# EAGLE design DTB_Brushed_Power_Board 2.0 (EAGLE 9.6.2)
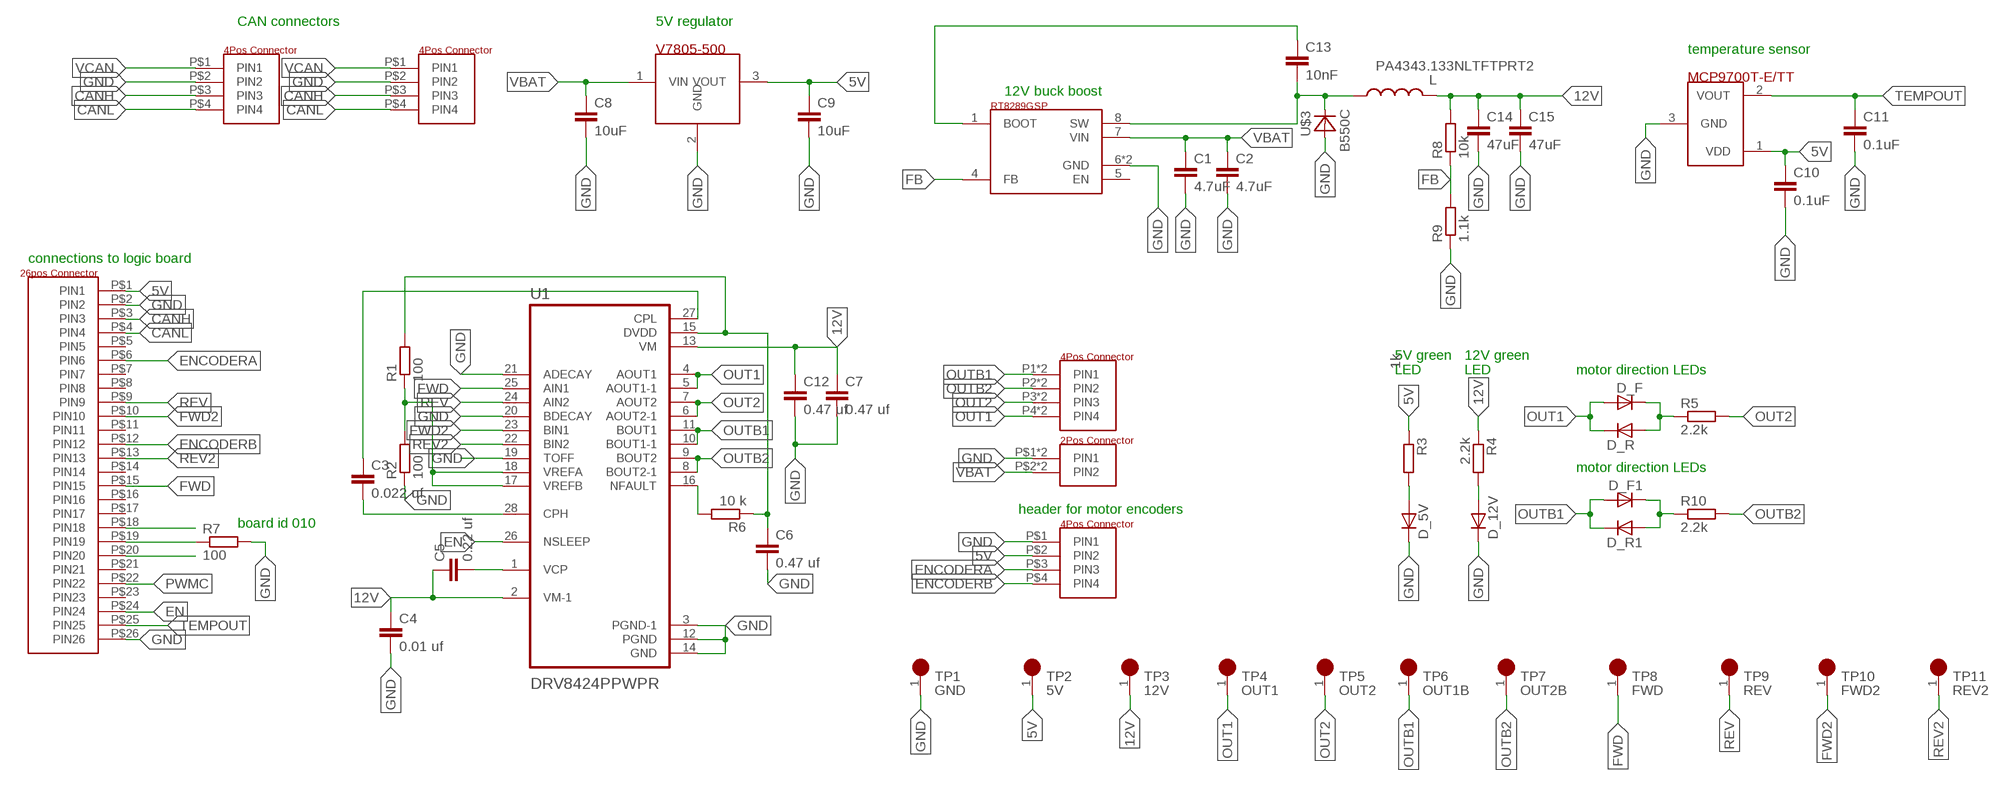
[diagram p0: schematic, sheet 1]

## Parts
C1  4.7uF  C-EUC1206  [C1206]
C2  4.7uF  C-EUC1206  [C1206]
C3  0.022 uf  C-EUC1206  [C1206]
C4  0.01 uf  C-EUC1206  [C1206]
C5  0.22 uf  C-EUC1206  [C1206]
C6  0.47 uf  C-EUC1206  [C1206]
C7  0.47 uf  C-EUC1206  [C1206]
C8  10uF  C-EUC1206  [C1206]
C9  10uF  C-EUC1206  [C1206]
C10  0.1uF  C-EUC0603  [C0603]
C11  0.1uF  C-EUC0603  [C0603]
C12  0.47 uf  C-EUC1206  [C1206]
C13  10nF  C-EUC1206  [C1206]
C14  47uF  C-EUC1206  [C1206]
C15  47uF  C-EUC1206  [C1206]
D_5V  LED0603  [DO0603]
D_12V  LED0603  [DO0603]
D_F  LED0603  [DO0603]
D_F1  LED0603  [DO0603]
D_R  LED0603  [DO0603]
D_R1  LED0603  [DO0603]
L  PA4343.133NLTFTPRT2  [INDM140128X650N]
R1  100  R-EU_R0603  [R0603]
R2  100  R-EU_R0603  [R0603]
R3  1k  R-EU_R0603  [R0603]
R4  2.2k  R-EU_R0603  [R0603]
R5  2.2k  R-EU_R0603  [R0603]
R6  10 k  R-EU_R0603  [R0603]
R7  100  R-EU_R0603  [R0603]
R8  10k  R-EU_R0603  [R0603]
R9  1.1k  R-EU_R0603  [R0603]
R10  2.2k  R-EU_R0603  [R0603]
TP1  GND  S2751-46R  [HARWIN_S2751-46R]
TP2  5V  S2751-46R  [HARWIN_S2751-46R]
TP3  12V  S2751-46R  [HARWIN_S2751-46R]
TP4  OUT1  S2751-46R  [HARWIN_S2751-46R]
TP5  OUT2  S2751-46R  [HARWIN_S2751-46R]
TP6  OUT1B  S2751-46R  [HARWIN_S2751-46R]
TP7  OUT2B  S2751-46R  [HARWIN_S2751-46R]
TP8  FWD  S2751-46R  [HARWIN_S2751-46R]
TP9  REV  S2751-46R  [HARWIN_S2751-46R]
TP10  FWD2  S2751-46R  [HARWIN_S2751-46R]
TP11  REV2  S2751-46R  [HARWIN_S2751-46R]
U1  DRV8424PPWPR  [IC_TPS61196PWPRQ1]
U$2  RT8289GSP  [SO8]
U$3  B550C  [SMC]
U$4  2POS_CONNECTOR,1X2_45A_POWERPOLE  [POWERPOLE_45A_1X2]
U$6  4POS_CONNECTORPOWERPOLE_1X4  [POWERPOLE_45A_1X4]
U$7  4POS_CONNECTORMOLEX_MICROFIT3.0_RA_4PIN_2ROW  [MOLEX_MICROFIT3.0_0430450400]
U$8  4POS_CONNECTORMOLEX_MICROFIT3.0_RA_4PIN_2ROW  [MOLEX_MICROFIT3.0_0430450400]
U$9  V7805-500  [SIP3]
U$10  26POS_CONNECTORN2526-6002-RB  [N2526-6002-RB]
U$11  MCP9700T-E/TT  [SOT23]
U$12  4POS_CONNECTOR.1"HEADER  [4POS_HEADER_.1"]

## Nets
5V: C9.1 C10.1 R3.1 TP2.1(TP) U$9.3(VOUT) U$10.P$1(PIN1) U$11.1(VDD) U$12.P$2(PIN2)
12V: C4.1 C5.1 C7.1 C12.1 C14.1 C15.1 L.2 R4.1 R8.2 TP3.1(TP) U1.2(VM-1) U1.13(VM)
BOOT: C13.1 U$2.1(BOOT)
CANH: U$7.P$3(PIN3) U$8.P$3(PIN3) U$10.P$3(PIN3)
CANL: U$7.P$4(PIN4) U$8.P$4(PIN4) U$10.P$4(PIN4)
EN: U1.26(NSLEEP) U$10.P$24(PIN24)
ENCODERA: U$10.P$6(PIN6) U$12.P$3(PIN3)
ENCODERB: U$10.P$12(PIN12) U$12.P$4(PIN4)
FB: R8.1 R9.2 U$2.4(FB)
FWD: TP8.1(TP) U1.25(AIN1) U$10.P$15(PIN15)
FWD2: TP10.1(TP) U1.23(BIN1) U$10.P$10(PIN10)
GND: C1.2 C2.2 C4.2 C6.2 C7.2 C8.2 C9.2 C10.2 C11.2 C12.2 C14.2 C15.2 D_5V.2(C) D_12V.2(C) R2.1 R7.2 R9.1 TP1.1(TP) U1.3(PGND-1) U1.12(PGND) U1.14(GND) U1.19(TOFF) U1.20(BDECAY) U1.21(ADECAY) U$2.6(GND) U$2.GND,EXPOSEDPAD(GND) U$3.A U$4.P$1(PIN1) U$4.P$5(PIN1) U$7.P$2(PIN2) U$8.P$2(PIN2) U$9.2(GND) U$10.P$2(PIN2) U$10.P$26(PIN26) U$11.3(GND) U$12.P$1(PIN1)
N$1: U$10.P$18(PIN18)
N$2: R6.2 U1.16(NFAULT)
N$3: D_F.2(C) D_R.1(A) R5.1
N$4: R7.1 U$10.P$19(PIN19)
N$5: U$10.P$20(PIN20)
N$6: C6.1 R1.2 R6.1 U1.15(DVDD)
N$7: D_5V.1(A) R3.2
N$8: D_12V.1(A) R4.2
N$9: C5.2 U1.1(VCP)
N$10: C13.2 L.1 U$2.8(SW) U$3.C
N$11: D_F1.2(C) D_R1.1(A) R10.1
N$14: R1.1 R2.2 U1.17(VREFB) U1.18(VREFA)
N$16: C3.2 U1.28(CPH)
OUT1: D_F.1(A) D_R.2(C) TP4.1(TP) U1.4(AOUT1) U1.5(AOUT1-1) U$6.P4(PIN4) U$6.P4B(PIN4)
OUT2: R5.2 TP5.1(TP) U1.6(AOUT2-1) U1.7(AOUT2) U$6.P3(PIN3) U$6.P3B(PIN3)
OUTB1: D_F1.1(A) D_R1.2(C) TP6.1(TP) U1.10(BOUT1-1) U1.11(BOUT1) U$6.P1(PIN1) U$6.P1B(PIN1)
OUTB2: R10.2 TP7.1(TP) U1.8(BOUT2-1) U1.9(BOUT2) U$6.P2(PIN2) U$6.P2B(PIN2)
PWMC: U$10.P$22(PIN22)
REV: TP9.1(TP) U1.24(AIN2) U$10.P$9(PIN9)
REV2: TP11.1(TP) U1.22(BIN2) U$10.P$13(PIN13)
TEMPOUT: C11.1 U$10.P$25(PIN25) U$11.2(VOUT)
VBAT: C1.1 C2.1 C8.1 U$2.7(VIN) U$4.P$2(PIN2) U$4.P$6(PIN2) U$9.1(VIN)
VBAT1: C3.1 U1.27(CPL)
VCAN: U$7.P$1(PIN1) U$8.P$1(PIN1)
Unconnected: U$2.5(EN) U$10.P$5(PIN5) U$10.P$7(PIN7) U$10.P$8(PIN8) U$10.P$11(PIN11) U$10.P$14(PIN14) U$10.P$16(PIN16) U$10.P$17(PIN17) U$10.P$21(PIN21) U$10.P$23(PIN23)

## Notes on the sheet
- CAN connectors | 5V regulator
- temperature sensor
- 12V buck boost
- connections to logic board
- 5V green
  LED
- 12V green
  LED
- motor direction LEDs
- motor direction LEDs
- header for motor encoders
- board id 010

## Library data of the parts
C1-C15 = rcl:C-EU: CAPACITOR, European symbol; SPICEPREFIX: C
D_5V D_12V D_F D_F1 D_R D_R1 = CMR:LED0603: LED size 0603 for debugging pic
L = CMR:PA4343.133NLT
R1-R10 = rcl:R-EU_: RESISTOR, European symbol; SPICEPREFIX: R
TP1-TP11 = CMR:S2751-46R: EZ-Test Point, SMT, tin, Tape and Reeled Check prices <https://pricing.snapeda.com/parts/S2751-46R/Harwin%20Inc./view-part?ref=eda>; AVAILABILITY: In Stock; DESCRIPTION: Natural PC Test Point Brass, Tin Plating Surface Mount Mounting Type; MF: Harwin Inc.; MP: S2751-46R; PACKAGE: None; PRICE: None; PURCHASE-URL: https://pricing.snapeda.com/search/part/S2751-46R/?ref=eda
U1 = DRV8424PPWPR:DRV8424PPWPR: None Check prices <https://pricing.snapeda.com/parts/DRV8424PPWPR/Texas%20Instruments/view-part?ref=eda>; AVAILABILITY: In Stock; DESCRIPTION: 35V, 2.5A bipolar stepper or dual brushed motor driver with integrated current sensing 28-HTSSOP -40 to 125; MF: Texas Instruments; MP: DRV8424PPWPR; PACKAGE: HTSSOP-28 Texas Instruments; PRICE: None; PURCHASE-URL: https://pricing.snapeda.com/search/part/DRV8424PPWPR/?ref=eda
U$2 = CMR:RT8289GSP: Voltage Regulator 24V sweep to 5V
U$3 = CMR:B550C: smc diode for voltage regulator 24 >> 5
U$4 = CMR:2POS_CONNECTOR: Harwin 2mm 2 POS Connector Male - https://www.digikey.com/product-detail/en/harwin-inc/M80-8520242/952-1769-ND/3727738 Female - https://www.digikey.com/product-detail/en/harwin-inc/M80-8980205/952-1182-ND/2264171
U$6-U$8 U$12 = CMR:4POS_CONNECTOR: 4 position connector could be header or connector
U$9 = CMR:V7805-500: Switching regulator (24V to 5V); max output current: 500mA
U$10 = CMR:26POS_CONNECTOR
U$11 = CMR:MCP9700T-E/TT: Analog Local Temperature Sensor

## Board
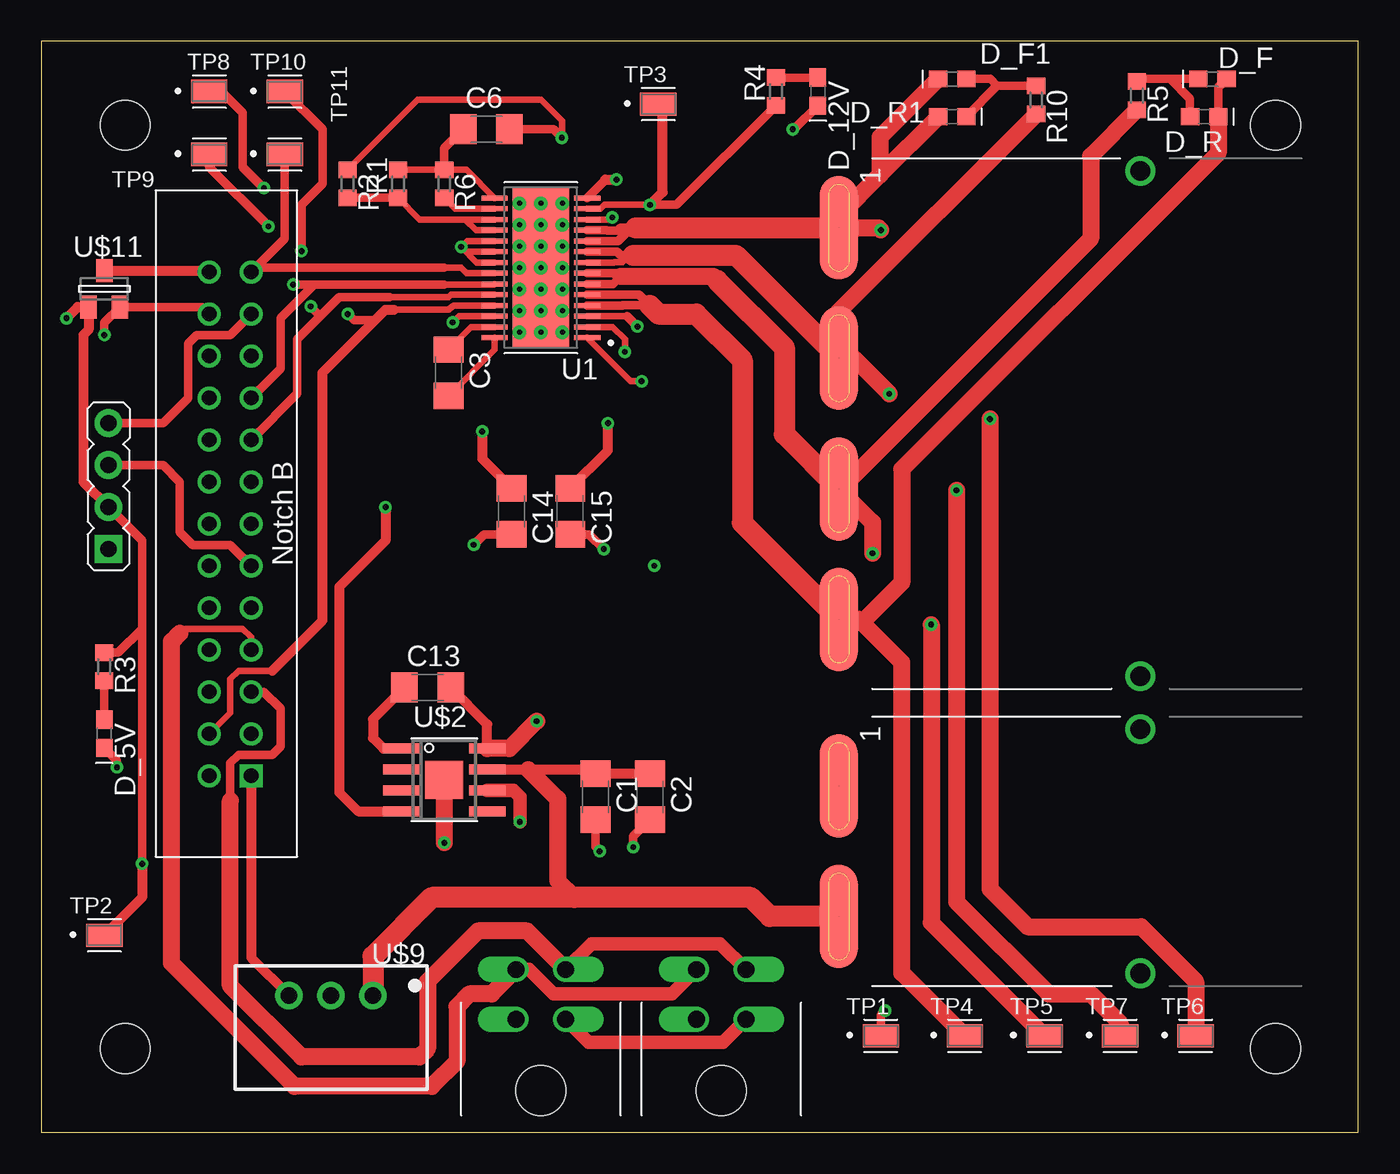
[diagram p1: board, top side]
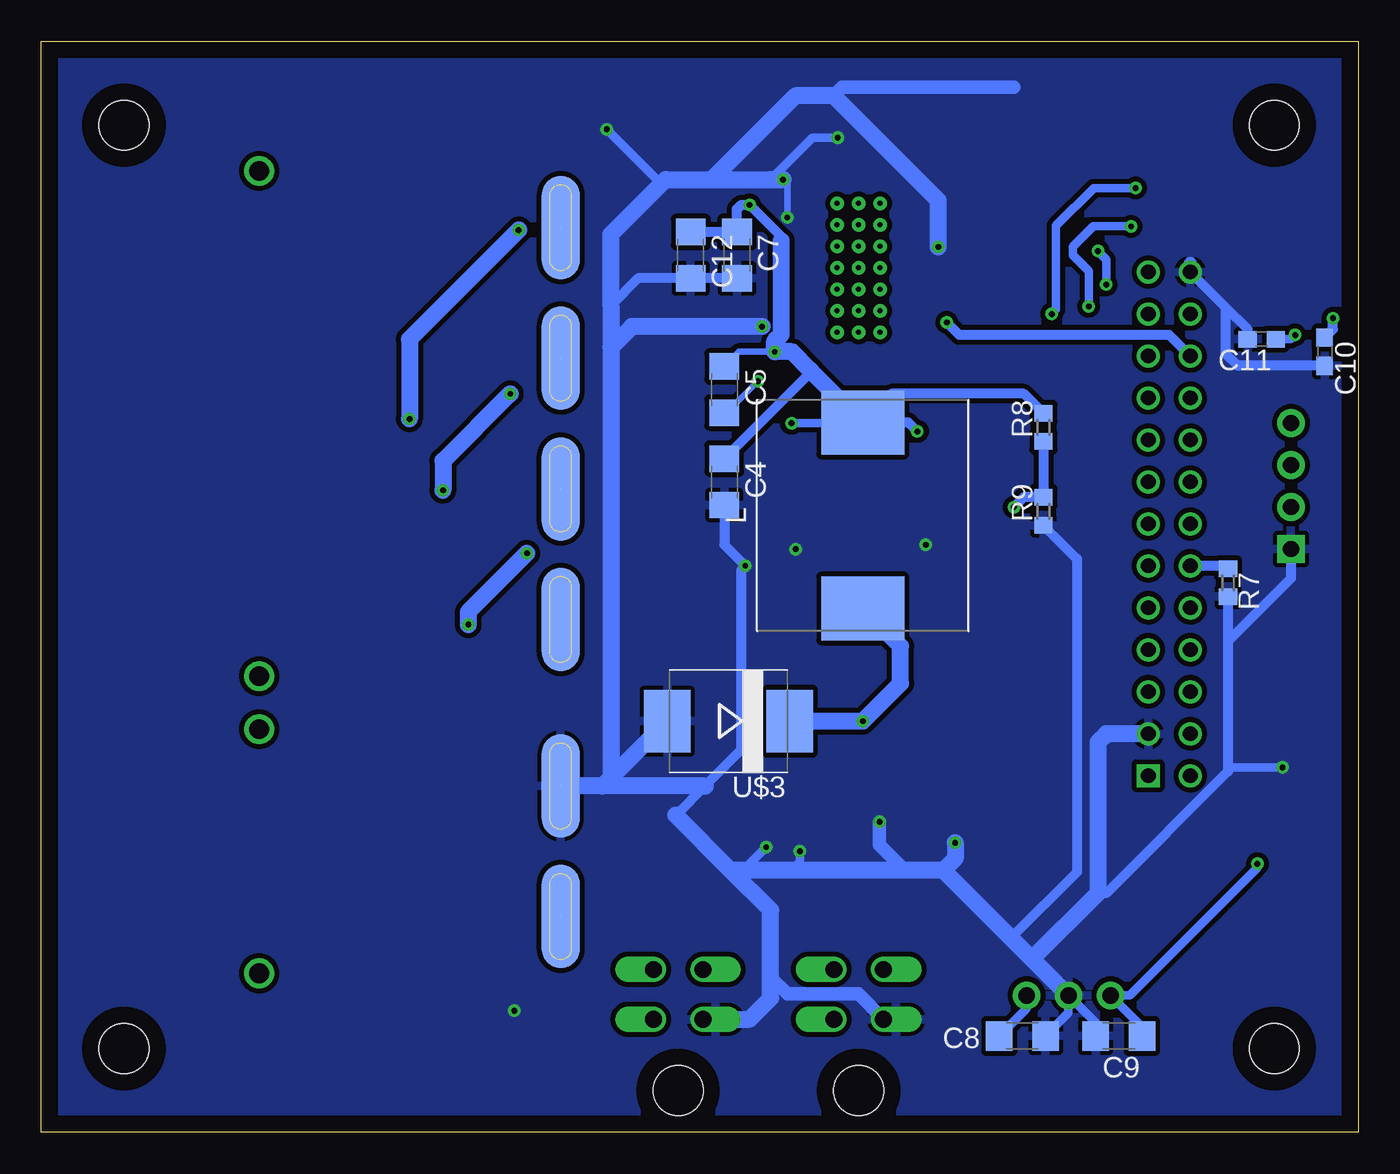
[diagram p2: board, bottom side, seen from below]

Size 79.68 x 66.03 mm. Coordinates in mm from the lower left corner, seen from the top.
Outline: 0,0 79.68,0 79.68,66.03 0,66.03 0,0
Copper layers (1*16): Top 0.035mm / dielectric 1.5mm / Bottom 0.035mm
Design rules "default *": minimum track width 6mil, minimum drill 0.35mm, track to track 6mil, track to pad 6mil, pad to pad 6mil, via to via 6mil, smd to smd 6mil, copper to edge 40mil, drill to drill 6mil, minimum pad ring 10mil, minimum via ring 8mil, stop-mask expansion 4mil, vias tented up to drill 0mil, thermal gap 10mil
Holes 3 mm at 5.08,60.96 74.68,60.96 74.68,5.08 5.08,5.08

### Footprints (pad centres in the part's own frame; a part is rotated, then mirrored left to right if it is on the bottom)
C1206 = smd 1.6 x 1.8: 1 -1.4,0; 2 1.4,0
C0603 = smd 1.1 x 1: 1 -0.85,0; 2 0.85,0
DO0603 = smd 1.1 x 1: 1 -0.85,0; 2 0.85,0
INDM140128X650N = smd 3.862 x 5.012: 1 -5.625,0; 2 5.625,0
R0603 = smd 1 x 1.1: 1 -0.85,0; 2 0.85,0
HARWIN_S2751-46R = smd 2.2 x 1.4: 1 0,0
IC_TPS61196PWPRQ1 = smd 1.6 x 0.3: 1 -2.8,4.225; 2 -2.8,3.575; 3 -2.8,2.925; 4 -2.8,2.275; 5 -2.8,1.625; 6 -2.8,0.975; 7 -2.8,0.325; 8 -2.8,-0.325; 9 -2.8,-0.975; 10 -2.8,-1.625; 11 -2.8,-2.275; 12 -2.8,-2.925; 13 -2.8,-3.575; 14 -2.8,-4.225; 15 2.8,-4.225; 16 2.8,-3.575; 17 2.8,-2.925; 18 2.8,-2.275; 19 2.8,-1.625; 20 2.8,-0.975; 21 2.8,-0.325; 22 2.8,0.325; 23 2.8,0.975; 24 2.8,1.625; 25 2.8,2.275; 26 2.8,2.925; 27 2.8,3.575; 28 2.8,4.225 | smd 3.4 x 9.7: 29 0,0 | drill 0.3 pad 0.5: 30 0,0; 31 0,1.3; 32 0,2.6; 33 0,3.9; 34 0,-1.3; 35 0,-2.6; 36 0,-3.9; 37 -1.3,3.9; 38 1.3,3.9; 39 -1.3,2.6; 40 1.3,2.6; 41 1.3,1.3; 42 -1.3,1.3; 43 -1.3,0; 44 1.3,0; 45 -1.3,-1.3; 46 1.3,-1.3; 47 -1.3,-2.6; 48 1.3,-2.6; 49 -1.3,-3.9; 50 1.3,-3.9
SO8 = smd 0.6 x 2.2: 1 -1.905,-2.6; 2 -0.635,-2.6; 3 0.635,-2.6; 4 1.905,-2.6; 5 1.905,2.6; 6 0.635,2.6; 7 -0.635,2.6; 8 -1.905,2.6 | smd 2.3 x 2.3: GND,EXPOSEDPAD 0,0
SMC = smd 2.8 x 3.8: A 3.7,0; C -3.7,0
POWERPOLE_45A_1X2 = smd 6.246 x 2.286: P$1 -3.95,0; P$2 3.95,0 | drill 1.2: P$3 -7.39,18.24; P$4 7.39,18.24 | smd 6.246 x 2.286 bottom: P$5 -3.95,0; P$6 3.95,0
POWERPOLE_45A_1X4 = smd 6.246 x 2.286: P1 -3.95,0; P2 3.95,0; P3 11.85,0; P4 19.75,0 | smd 6.246 x 2.286 bottom: P1B -3.95,0; P2B 3.95,0; P3B 11.85,0; P4B 19.75,0 | drill 1.2: P$3 -7.39,18.24; P$4 23.19,18.24
MOLEX_MICROFIT3.0_0430450400 = drill 1.02 offset: P$1 1.5,4.32; P$2 -1.5,4.32; P$3 1.5,7.32; P$4 -1.5,7.32 | hole 3: 0,0
SIP3 = drill 1 pad 1.676: 1 -2.54,-1.943; 2 0,-1.943; 3 2.54,-1.943
N2526-6002-RB = drill 0.889 square: P$1 0,0 | drill 0.889: P$2 2.54,0; P$3 5.08,0; P$4 7.62,0; P$5 10.16,0; P$6 12.7,0; P$7 15.24,0; P$8 17.78,0; P$9 20.32,0; P$10 22.86,0; P$11 25.4,0; P$12 27.94,0; P$13 30.48,0; P$14 0,2.54; P$15 2.54,2.54; P$16 5.08,2.54; P$17 7.62,2.54; P$18 10.16,2.54; P$19 12.7,2.54; P$20 15.24,2.54; P$21 17.78,2.54; P$22 20.32,2.54; P$23 22.86,2.54; P$24 25.4,2.54; P$25 27.94,2.54; P$26 30.48,2.54
SOT23 = smd 1 x 1.4: 1 -0.95,-1.1; 2 0.95,-1.1; 3 0,1.1
4POS_HEADER_.1" = drill 0.991 pad 1.676 square: P$1 0,0 | drill 0.991 pad 1.676: P$2 2.54,0; P$3 5.08,0; P$4 7.62,0

### Placement (x,y rotation side)
C1  33.53,20.32 270 top
C2  36.83,20.32 270 top
C3  24.64,45.97 270 top
C4  38.35,39.37 270 bottom
C5  38.35,44.96 270 bottom
C6  26.92,60.71 0 top
C7  37.59,53.09 270 bottom
C8  20.32,5.84 0 bottom
C9  14.48,5.84 180 bottom
C10  2.03,47.24 270 bottom
C11  5.84,48.01 180 bottom
C12  40.39,53.09 270 bottom
C13  23.37,26.92 0 top
C14  28.45,37.59 270 top
C15  32,37.59 270 top
D_5V  3.81,24.13 270 top
D_12V  46.99,62.99 270 top
D_F  70.87,63.75 180 top
D_F1  55.12,61.47 0 top
D_R  70.36,61.47 0 top
D_R1  55.12,63.75 180 top
L  29.97,37.34 90 bottom
R1  21.59,57.4 90 top
R2  18.54,57.4 270 top
R3  3.81,28.19 270 top
R4  44.45,62.99 90 top
R5  66.29,62.74 270 top
R6  24.38,57.4 270 top
R7  7.87,33.27 270 bottom
R8  19.05,42.67 90 bottom
R9  19.05,37.59 90 bottom
R10  60.2,62.48 270 top
TP1  50.8,5.84 0 top
TP2  3.81,11.94 0 top
TP3  37.34,62.23 0 top
TP4  55.88,5.84 0 top
TP5  60.71,5.84 0 top
TP6  69.85,5.84 0 top
TP7  65.28,5.84 0 top
TP8  10.16,62.99 0 top
TP9  10.16,59.18 0 top
TP10  14.73,62.99 0 top
TP11  14.73,59.18 0 top
U1  30.23,52.32 180 top
U$2  24.38,21.34 270 top
U$3  38.1,24.89 180 bottom
U$4  48.26,17.02 270 top
U$6  48.26,50.8 270 top
U$7  41.15,2.54 0 top
U$8  30.23,2.54 0 top
U$9  17.53,6.35 180 top
U$10  12.7,21.59 90 top
U$11  3.81,51.05 0 top
U$12  4.06,35.31 90 top

### Tracks (layer width: path | path; a pad name or v marks a point on that pad's centre or on a via)
5V  (via drill 0.35)
  Top 0.508: v6.1,16.26 6.1,30.48 | 6.1,30.48 6.1,35.81 U$12.P$2 | R3.1 4.66,29.04 6.1,30.48
  Top 0.61: U$9.3 12.7,10.58 U$10.P$1 | v1.52,49.28 2.2,49.95 U$11.1 2.86,48.58 2.54,48.26 2.54,39.37 U$12.P$2 | v6.1,16.26 6.1,14.22 TP2.1
  Bottom 0.508: C9.1 13.08,6.39 U$9.3 13.8,8.29 6.1,16 v6.1,16.26
  Bottom 0.61: C10.1 1.52,48.6 v1.52,49.28
12V  (via drill 0.35)
  Top 0.406: U1.2 34.56,48.75 35.31,48.01 v35.31,47.24 | v36.83,56.13 34.06,56.13 33.83,55.9 U1.13
  Top 0.508: R4.1 38.44,56.13 v36.83,56.13
  Top 0.61: v26.67,42.42 26.67,40.77 C14.1 | C15.1 34.29,41.28 v34.29,42.93 | v36.83,56.13 37.59,56.9 37.59,61.98 TP3.1
  Bottom 0.406: v35.31,47.24 37.47,47.24 C5.1
  Bottom 0.508: v34.29,42.93 29.5,42.93 29.46,42.96
  Bottom 0.61: R8.2 20.23,44.7 28.23,44.7 L.2 | v26.67,42.42 27.21,42.96 29.46,42.96 L.2 | 30.01,42.93 L.2 | C4.1 33.13,45.99 33.13,46.12 | C12.1 C7.1 37.59,55.88 37.34,56.13 v36.83,56.13 34.9,54.2 34.9,53.95
  Bottom 1.016: L.2 33.13,46.12 34.25,47.24 v35.31,47.24 35.31,47.88 34.9,48.28 34.9,53.95
BOOT
  Top 0.61: C13.1 20.07,25.02 20.07,23.88 20.7,23.24 U$2.1
CANH
  Top 0.508: 11.43,20.07 11.43,22.35 11.94,22.86 13.97,22.86 14.48,23.37 14.48,25.65 13.46,26.67 U$10.P$3
  Top 0.813: U$8.P$3 33.3,11.43 41.08,11.43 U$7.P$3
  Top 1.016: U$8.P$3 29.39,12.19 26.42,12.19 23.37,9.14 23.37,5.08 22.86,4.57 15.75,4.57 11.43,8.89 11.43,20.07
CANL
  Top 0.406: 8.38,30.23 8.64,30.48 12.19,30.48 12.7,29.97 U$10.P$4
  Top 0.813: U$8.P$4 29.51,9.86 30.99,8.38 38.17,8.38 U$7.P$4
  Top 1.016: U$8.P$4 27.25,8.38 25.91,8.38 25.15,7.62 25.15,4.32 23.62,2.79 15.32,2.79 7.87,10.24 7.87,29.72 8.38,30.23
EN  (via drill 0.35)
  Top 0.406: U1.26 25.27,49.4 v24.89,49.02
  Bottom 0.61: U$10.P$24 11.43,48.26 24.13,48.26 v24.89,49.02
ENCODERA
  Top 0.508: U$12.P$3 7.37,40.39 8.38,39.37 8.38,36.32 9.14,35.56 11.43,35.56 U$10.P$6
ENCODERB
  Top 0.508: U$12.P$4 7.37,42.93 8.89,44.45 8.89,47.75 9.4,48.26 11.43,48.26 U$10.P$12
FB  (via drill 0.35)
  Top 0.61: v20.83,37.85 20.83,35.81 18.03,33.02 18.03,20.57 19.18,19.43 U$2.4
  Bottom 0.61: R8.1 R9.2 20.23,38.44 v20.83,37.85
FWD  (via drill 0.35)
  Top 0.406: U1.25 24.93,50.05 24.87,49.99 24.84,49.99 24.64,49.78 21.34,49.78 | U$10.P$15 11.43,25.4 11.43,27.43 11.94,27.94 13.97,27.94
  Top 0.508: 20.19,49.15 18.92,49.15 v18.54,49.53 | v13.46,57.15 12.19,58.42 12.19,61.72 10.92,62.99 TP8.1
  Top 0.61: 13.97,27.94 17.02,30.99 17.02,45.97 20.19,49.15 20.83,49.78 21.34,49.78
  Bottom 0.508: v18.54,49.53 18.29,49.78 18.29,54.86 16,57.15 v13.46,57.15
FWD2  (via drill 0.35)
  Top 0.406: 24.38,51.31 27.38,51.31 U1.23
  Top 0.508: U$10.P$10 14.48,46.23 14.48,49.28 16.51,51.31 | 24.38,51.31 16.51,51.31 | 16.51,51.31 v15.24,51.31 | TP10.1 17.02,60.71 17.02,57.4 15.75,56.13 v15.75,53.34
  Bottom 0.508: v15.24,51.31 15.24,52.83 v15.75,53.34
GND  (via drill 0.35)  (1 unrouted)
  Top 0.406: U1.3 35.44,49.4 | U1.12 34.42,55.25 v34.54,55.37 | R2.1 22.77,62.48 30.23,62.48 31.5,61.21 v31.5,60.2 | U1.19 25.76,53.95 v25.4,53.59 | U1.20 25.7,53.3 v25.4,53.59 | U1.21 26.34,52.65 v25.4,53.59
  Top 0.508: 35.44,49.4 v36.07,48.77 | C6.2 30.99,60.71 v31.5,60.2 | D_12V.2 45.55,60.71 v45.47,60.71 | D_5V.2 4.57,22.52 v4.57,22.1 | C1.2 33.53,17.27 v33.78,17.02 | C2.2 35.81,17.9 v35.81,17.27 | U1.14 34.13,57.66 | C14.2 26.79,36.19 v26.16,35.56 | C15.2 33.15,36.19 v34.04,35.31 | TP1.1 50.8,7.11 v51.05,7.37
  Top 0.61: 34.13,57.66 v34.8,57.66 | U$11.3 10.08,52.15 U$10.P$26
  Top 0.813: U$2.6 28.58,20.7 28.96,20.32 v28.96,18.8
  Top 1.016: U$2.GND,EXPOSEDPAD v24.38,17.53
  Bottom 0.406: v34.54,55.37 34.54,57.4 v34.8,57.66
  Bottom 0.508: C9.2 15.88,6.64 U$9.2 17.53,7.24 C8.2 | 33.53,16 33.53,15.88 | v31.5,60.2 33.02,60.2 35.56,57.66 | v45.47,60.71 42.42,57.66 41.91,57.66 | v4.57,22.1 7.62,22.1 7.87,21.84 | v33.78,17.02 33.78,16.38 34.29,15.88 | v35.81,17.27 37.21,15.88 37.97,15.88
  Bottom 0.61: R9.1 17.02,34.71 17.02,15.75 21,11.77 | 41.29,19.19 39.51,20.97 37.34,23.14 37.34,34.04 v37.08,34.29 38.35,35.56 C4.2 | C7.2 C12.2 43.56,51.69 45.21,50.04 | R7.2 7.87,29.72 | 7.87,29.72 7.87,21.84 15.24,14.48 15.75,14.48 | U$12.P$1 4.06,33.53 7.87,29.72 | C11.2 6.69,48.6 8,49.91 | 8,49.91 U$10.P$26 | C10.2 7.28,46.39 8,47.12 8,49.91
  Bottom 0.813: U$8.P$2 30.25,8.38 34.54,8.38 35.56,9.4 | v28.96,18.8 28.96,17.4 27.43,15.88 | U$10.P$26 10.16,52.58 | 20.83,63.25 31.24,63.25 31.75,62.74
  Bottom 1.016: U$7.P$2 36.83,6.86 35.56,8.13 35.56,9.4 35.56,13.46 37.97,15.88 | 39.51,20.97 U$4.P$5 | 37.97,15.88 41.29,19.19 | U$9.2 19.73,10.5 | 19.73,10.5 21,11.77 25.11,15.88 | 25.11,15.88 27.43,15.88 33.53,15.88 34.29,15.88 37.97,15.88 | 48.26,23 U$4.P$5 | U$3.A 45.21,21.48 | 45.21,21.48 45.72,20.97 U$4.P$5 | 45.21,47.5 45.21,50.04 45.21,54.36 41.91,57.66 39.12,57.66 | 45.21,47.5 45.21,21.48 | v36.07,48.77 43.94,48.77 45.21,47.5 | 39.12,57.66 35.56,57.66 v34.8,57.66 | v25.4,53.59 25.4,56.39 31.75,62.74 34.04,62.74 39.12,57.66 | v24.38,17.53 24.38,16.6 25.11,15.88 | U$10.P$2 15.24,24.13 15.75,23.62 15.75,14.48 19.73,10.5
  pour Bottom (isolate 0.305): 0,66.04 79.76,66.04 79.76,0 0,0 0,65.28
N$2
  Top 0.406: U1.16 25.04,55.9 R6.2
N$3
  Top 0.508: R5.1 66.46,63.75 68.33,63.75 | 68.33,63.75 D_F.2 | D_R.1 69.51,62.57 68.33,63.75
N$4
  Bottom 0.61: R7.1 8.04,34.29 U$10.P$19
N$6
  Top 0.406: U1.15 25.72,58.25 R6.1 R1.2
  Top 0.508: R6.1 24.38,59.57 C6.1
N$7
  Top 0.508: D_5V.1 R3.2
N$8
  Top 0.508: R4.2 D_12V.1
N$9  (via drill 0.35)
  Top 0.406: U1.1 35.66,45.47 v36.32,45.47
  Bottom 0.406: v36.32,45.47 38.23,43.56 C5.2
N$10  (via drill 0.35)
  Top 0.61: U$2.8 26.98,24.71 C13.2
  Top 1.016: v29.97,24.89 28.32,23.24 U$2.8
  Bottom 1.016: U$3.C v29.97,24.89 27.69,27.18 27.69,29.43 L.1
N$11
  Top 0.508: D_F1.2 57.83,63.33 | 57.83,63.33 R10.1 | D_R1.1 57.41,63.75 57.83,63.33
N$14
  Top 0.406: R1.1 22.9,55.25 25.65,55.25 | 25.65,55.25 U1.17 | U1.18 26.3,54.6 25.65,55.25
  Top 0.508: R2.2 R1.1
N$16
  Top 0.406: C3.2 27.43,47.36 U1.28
OUT1  (1 unrouted)
  Top 0.508: D_F.1 71.21,63.25 D_R.2 | 49.85,31.05 U$6.P4B | U1.5 36.17,50.7 36.81,50.06 | U1.4 35.15,50.05 35.16,50.06 36.81,50.06 | 36.81,50.06 36.83,50.04
  Top 1.016: D_R.2 71.21,59.27 52.07,40.13 52.07,33.27 49.85,31.05 | TP4.1 52.07,9.65 52.07,28.45 49.47,31.05 U$6.P4B
  Top 1.27: 36.83,50.04 37.34,49.53 39.62,49.53 42.42,46.74 42.42,36.89 U$6.P4B
OUT2  (via drill 0.35)  (1 unrouted)
  Top 0.508: 48.35,38.95 U$6.P3 | U1.7 34.87,52 35.05,51.82 34.59,51.35 U1.6
  Top 1.016: R5.2 63.5,59.09 63.5,54.1 48.35,38.95 | 35.05,51.82 35.25,51.82 35.28,51.79 40.66,51.79 40.89,51.56 | U$6.P3 50.29,36.92 v50.29,35.05 | v53.85,30.73 53.85,12.7 TP5.1
  Top 1.27: 40.89,51.56 44.96,47.5 44.96,42.25 U$6.P3
  Bottom 1.016: v50.29,35.05 53.85,31.5 v53.85,30.73
OUTB1  (via drill 0.35)  (1 unrouted)
  Top 0.508: 48.26,55.46 U$6.P1B | 35.7,54.75 35.03,54.75 34.87,54.59 34.22,54.59 34.21,54.6 U1.11 | 35.66,54.46 35.95,54.75 35.7,54.75 | U1.10 34.9,53.95 35.7,54.75
  Top 1.016: 47.87,54.36 U$6.P1B 50.66,54.75 v50.8,54.61 | D_F1.1 50.76,57.96 | 50.76,57.96 48.26,55.46 | D_R1.2 50.76,60.24 50.76,57.96 | v57.4,43.18 57.4,14.73 59.69,12.45 66.55,12.45 69.85,9.14 TP6.1
  Top 1.27: 35.95,54.75 U$6.P1B
  Bottom 1.016: v50.8,54.61 57.4,48.01 v57.4,43.18
OUTB2  (via drill 0.35)  (1 unrouted)
  Top 0.406: U1.8 34.66,52.65 34.69,52.68 35.15,52.68 35.56,53.09
  Top 0.508: 35.6,53.3 35.81,53.09 | 35.63,52.9 35.81,53.09 | U1.9 34.84,53.3 35.05,53.09 35.56,53.09 35.81,53.09
  Top 1.016: R10.2 48.26,49.7 U$6.P2B 49.16,46.85 v51.31,44.7 | v55.37,38.86 55.37,13.97 60.96,8.38 63.5,8.38 65.28,6.6 TP7.1
  Top 1.27: 35.81,53.09 42.02,53.09 U$6.P2B
  Bottom 1.016: v51.31,44.7 55.37,40.64 v55.37,38.86
REV  (via drill 0.35)
  Top 0.406: U1.24 24.79,50.7 24.64,50.55 21.08,50.55
  Top 0.508: U$10.P$9 15.49,44.7 15.49,48.01 16.76,49.28 | 21.08,50.55 18.03,50.55 16.76,49.28 | 16.76,49.28 16.76,49.53 v16.3,49.99 | v13.74,54.84 10.16,58.42 TP9.1
  Bottom 0.508: v16.3,49.99 16.3,52.12 17.27,53.09 17.27,53.59 16.03,54.84 v13.74,54.84
REV2
  Top 0.406: 24.38,52.32 25.4,52.32 25.73,52 U1.22
  Top 0.508: 24.38,52.32 12.95,52.32 U$10.P$13 14.73,54.1 TP11.1
TEMPOUT  (via drill 0.35)
  Top 0.508: U$10.P$25 9.74,49.95 U$11.2 3.81,49 v3.81,48.26
  Bottom 0.508: C11.1 4.06,48.01 v3.81,48.26
VBAT  (1 unrouted)
  Top 0.61: U$2.7 29.46,21.97 33.28,21.97 C1.1 C2.1
  Top 1.016: 29.46,21.97 31.24,20.19 31.24,15.24 32.26,14.22
  Top 1.27: U$4.P$2 44.08,13.07 42.93,14.22 32.26,14.22 23.62,14.22 20.07,10.67 U$9.1
  Bottom 0.508: C8.1 20.07,7.5 U$9.1
VBAT1
  Top 0.406: C3.1 26.01,48.75 U1.27
VCAN
  Top 0.813: U$7.P$1 41.25,5.46 33.12,5.46 U$8.P$1